# Altium schematic sheet BoostRegulator.SchDoc
size A4; SheetNumber: 3; SheetTotal: 3
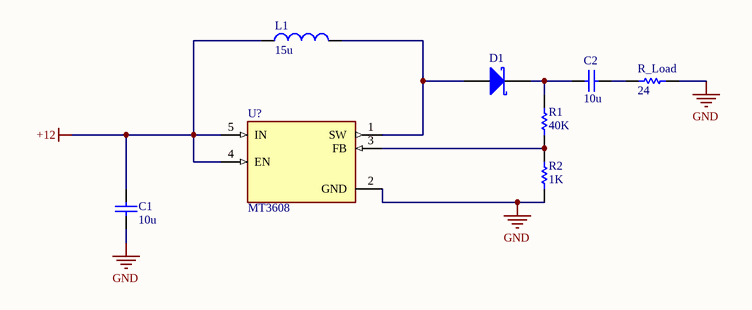
[diagram p0: BoostRegulator.SchDoc]

## Parts
C1  value 10u  (hidden comment: Capacitor)
C2  value 10u  (hidden comment: Capacitor)
D1  Schottky Diode  (value not drawn)
L1  value 15u  (hidden comment: Inductor)
R1  value 40K  (hidden comment: Resistor)
R2  value 1K  (hidden comment: Resistor)
R_Load  value 24  (hidden comment: Resistor)
U?  MT3608  [SOT95P280X145-6N]

## Nets
+12: C1.2 L1.1 U?.4(EN) U?.5(IN)
GND: C1.1 R2.1 R_Load.2 U?.2(GND)
NetC2_1: C2.1 D1.2(K) R1.2
NetC2_2: C2.2 R_Load.1
NetD1_1: D1.1(A) L1.2 U?.1(SW)
NetR1_1: R1.1 R2.2 U?.3(FB)

## Library data of the parts
C1 C2 = Capacitor: SimulationGenericComponent: True
D1 = Schottky Diode: AF: 1; BV: 0; BV_MAX: 1e99; EG: 1.11; FC: 0.5; IBV: 0.001; IS: 1e-14; MJSW: 0.33; NTUN: 30; TNOM: 27; XTI: 3; SimulationGenericComponent: True; CJO: 0; CJP: 0; CTA: 0; CTP: 0; FCS: 0.5; FV_MAX: 1e99; IKF: 0; IKR: 0; ISR: 1e-14; JSW: 0; JTUN: 0; JTUNSW: 0; KEG: 1; KF: 0; LEVEL: 1; N: 1; NBV: 1; NR: 1; NS: 1; PHP: 1; RS: 0; TCV: 0; TLEV: 0; TLEVC: 0; TM1: 0; TM2: 0; TPB: 0; TPHP: 0; TRS: 0; TRS2: 0; TT: 0; TTT1: 0; TTT2: 0; VJ: 1; XTITUN: 3
L1 = Inductor: SimulationGenericComponent: True
R1 R2 R_Load = Resistor: TC1: 0; SimulationGenericComponent: True; TC2: 0
U? = MT3608: High Efficiency 1.2MHz2A Step Up Converter; MF: Aerosemi Technology Co., Ltd; Price: None; Availability: Not in stock; Package: Package; MP: MT3608; Value: *; SnapEDA_Link: https://www.snapeda.com/parts/MT3608/Aerosemi+Technology+Co.%252C+Ltd/view-part/?ref=snap; Check_prices: https://www.snapeda.com/parts/MT3608/Aerosemi+Technology+Co.%252C+Ltd/view-part/?ref=eda